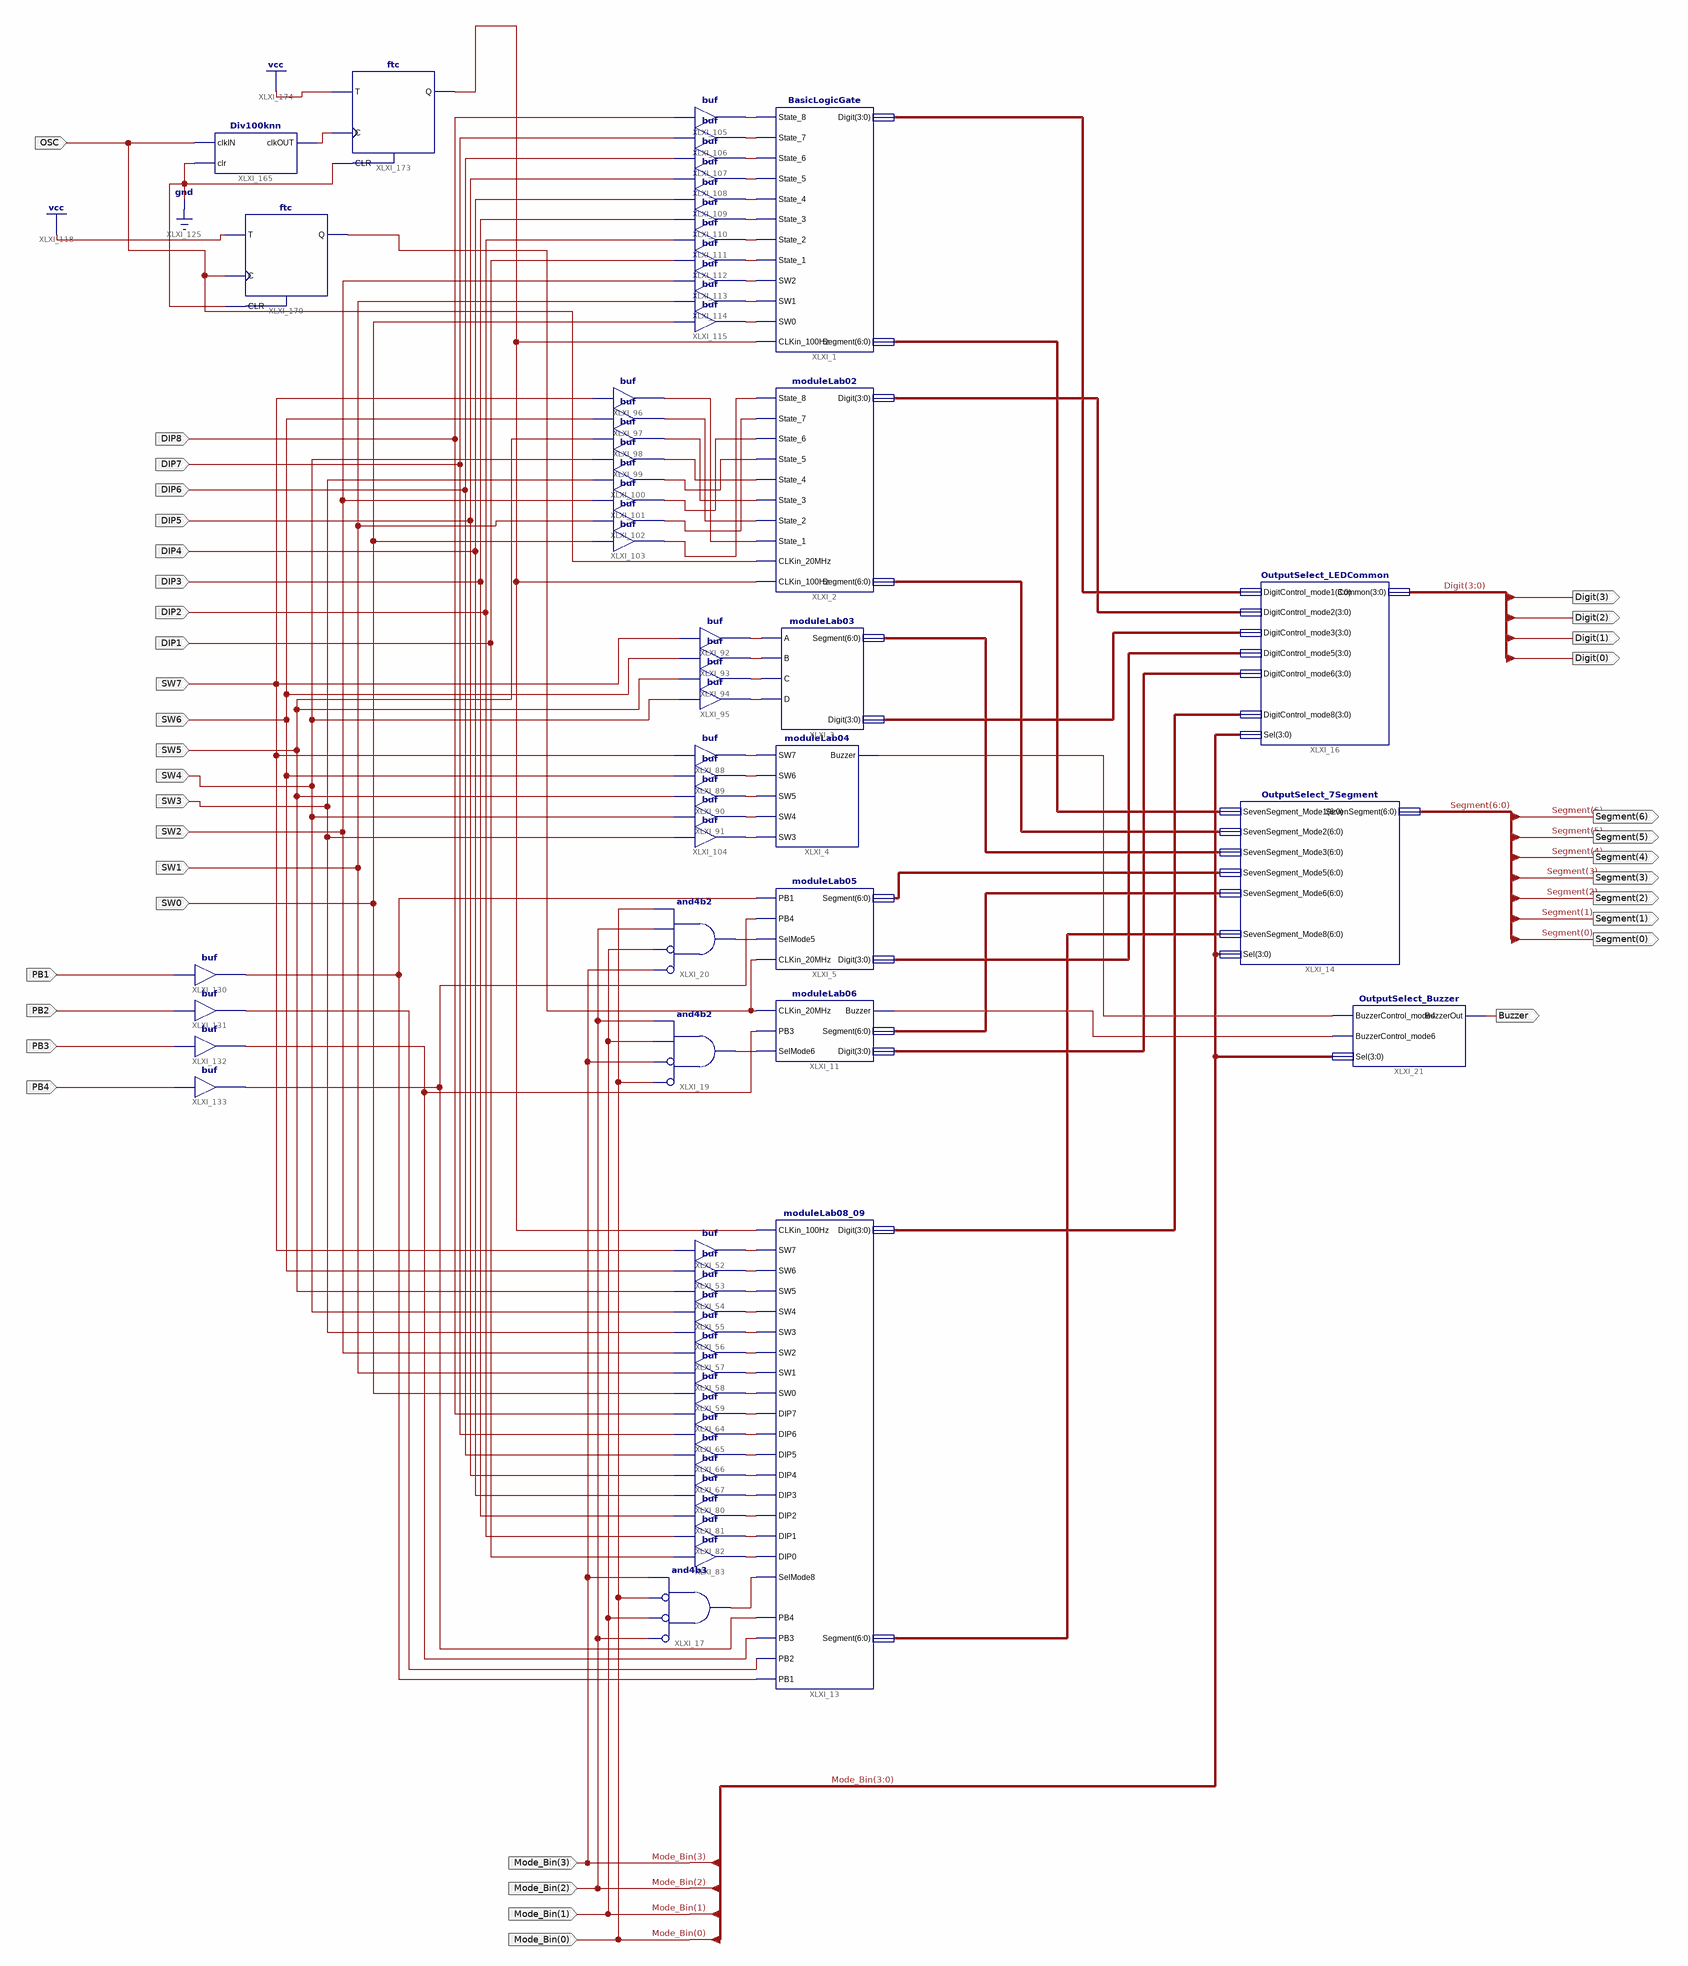
[diagram p0: schematic sheet 1]
// Xilinx ISE schematic main.sch (spartan6) as structural Verilog: 64 symbols, 37 ports
module main (
  input  [3:0] Mode_Bin,
  input  DIP7,
  input  DIP6,
  input  DIP5,
  input  DIP4,
  input  DIP3,
  input  DIP2,
  input  DIP1,
  input  SW7,
  input  SW6,
  input  SW5,
  input  SW4,
  input  SW3,
  input  SW2,
  input  SW1,
  input  SW0,
  input  DIP8,
  input  PB4,
  input  PB2,
  input  PB1,
  input  PB3,
  input  OSC,
  output [3:0] Digit,
  output [6:0] Segment,
  output Buzzer
);

  wire XLXN_35, XLXN_37, XLXN_69, XLXN_70, XLXN_182, XLXN_183, XLXN_184, XLXN_185, XLXN_186, XLXN_187,
       XLXN_188, XLXN_189, XLXN_190, XLXN_195, XLXN_196, XLXN_197, XLXN_198, XLXN_217, XLXN_218, XLXN_219,
       XLXN_220, XLXN_225, XLXN_226, XLXN_227, XLXN_228, XLXN_229, XLXN_230, XLXN_231, XLXN_232, XLXN_241,
       XLXN_242, XLXN_243, XLXN_244, XLXN_245, XLXN_246, XLXN_247, XLXN_248, XLXN_249, XLXN_250, XLXN_251,
       XLXN_252, XLXN_322, XLXN_326, XLXN_329, XLXN_339, XLXN_340, XLXN_341, XLXN_342, XLXN_343, XLXN_344,
       XLXN_345, XLXN_346, XLXN_397, XLXN_409, XLXN_423, XLXN_425;
  wire [3:0] XLXN_17, XLXN_22, XLXN_23, XLXN_24, XLXN_25, XLXN_26;
  wire [6:0] XLXN_1, XLXN_2, XLXN_3, XLXN_4, XLXN_5, XLXN_9;

  BasicLogicGate XLXI_1 (
    .State_6(XLXN_244), .State_2(XLXN_248), .SW2(XLXN_250), .Digit(XLXN_25), .Segment(XLXN_1),
    .SW1(XLXN_251), .CLKin_100Hz(XLXN_423), .SW0(XLXN_252), .State_8(XLXN_242), .State_7(XLXN_243),
    .State_5(XLXN_245), .State_4(XLXN_246), .State_3(XLXN_247), .State_1(XLXN_249));
  moduleLab02 XLXI_2 (
    .CLKin_20MHz(OSC), .CLKin_100Hz(XLXN_423), .Digit(XLXN_24), .Segment(XLXN_2), .State_6(XLXN_344),
    .State_7(XLXN_345), .State_8(XLXN_346), .State_5(XLXN_343), .State_2(XLXN_340), .State_3(XLXN_341),
    .State_1(XLXN_339), .State_4(XLXN_342));
  moduleLab04 XLXI_4 (.SW7(XLXN_225), .SW6(XLXN_226), .SW5(XLXN_227), .SW4(XLXN_228), .SW3(XLXN_241), .Buzzer(XLXN_70));
  moduleLab03 XLXI_3 (.A(XLXN_229), .B(XLXN_230), .C(XLXN_231), .D(XLXN_232), .Segment(XLXN_3), .Digit(XLXN_26));
  moduleLab05 XLXI_5 (
    .Segment(XLXN_4), .Digit(XLXN_23), .SelMode5(XLXN_182), .CLKin_20MHz(XLXN_409), .PB1(XLXN_322),
    .PB4(XLXN_329));
  moduleLab06 XLXI_11 (
    .CLKin_20MHz(XLXN_409), .PB3(XLXN_326), .SelMode6(XLXN_37), .Buzzer(XLXN_69), .Segment(XLXN_5),
    .Digit(XLXN_22));
  moduleLab08_09 XLXI_13 (
    .CLKin_100Hz(XLXN_423), .SW0(XLXN_190), .DIP7(XLXN_195), .DIP6(XLXN_196), .DIP5(XLXN_197),
    .DIP4(XLXN_198), .DIP3(XLXN_217), .DIP2(XLXN_218), .DIP1(XLXN_219), .DIP0(XLXN_220), .Digit(XLXN_17),
    .Segment(XLXN_9), .SelMode8(XLXN_35), .SW1(XLXN_189), .SW2(XLXN_188), .SW3(XLXN_187), .SW4(XLXN_186),
    .SW5(XLXN_185), .SW6(XLXN_184), .SW7(XLXN_183), .PB4(XLXN_329), .PB3(XLXN_326), .PB2(XLXN_397),
    .PB1(XLXN_322));
  OutputSelect_7Segment XLXI_14 (
    .SevenSegment_Mode1(XLXN_1), .SevenSegment_Mode2(XLXN_2), .SevenSegment_Mode3(XLXN_3),
    .SevenSegment_Mode5(XLXN_4), .SevenSegment_Mode6(XLXN_5), .SevenSegment_Mode8(XLXN_9), .Sel(Mode_Bin),
    .SevenSegment(Segment));
  OutputSelect_LEDCommon XLXI_16 (
    .DigitControl_mode1(XLXN_25), .DigitControl_mode2(XLXN_24), .DigitControl_mode3(XLXN_26),
    .DigitControl_mode5(XLXN_23), .DigitControl_mode6(XLXN_22), .DigitControl_mode8(XLXN_17), .Sel(Mode_Bin),
    .Common(Digit));
  and XLXI_17 (XLXN_35, ~Mode_Bin[2], ~Mode_Bin[1], ~Mode_Bin[0], Mode_Bin[3]);  // and4b3
  and XLXI_19 (XLXN_37, ~Mode_Bin[0], ~Mode_Bin[3], Mode_Bin[1], Mode_Bin[2]);  // and4b2
  OutputSelect_Buzzer XLXI_21 (
    .BuzzerControl_mode4(XLXN_70), .BuzzerControl_mode6(XLXN_69), .Sel(Mode_Bin), .BuzzerOut(Buzzer));
  buf XLXI_52 (XLXN_183, SW7);
  buf XLXI_53 (XLXN_184, SW6);
  buf XLXI_54 (XLXN_185, SW5);
  buf XLXI_55 (XLXN_186, SW4);
  buf XLXI_56 (XLXN_187, SW3);
  buf XLXI_57 (XLXN_188, SW2);
  buf XLXI_58 (XLXN_189, SW1);
  buf XLXI_59 (XLXN_190, SW0);
  buf XLXI_64 (XLXN_195, DIP8);
  buf XLXI_65 (XLXN_196, DIP7);
  buf XLXI_66 (XLXN_197, DIP6);
  buf XLXI_67 (XLXN_198, DIP5);
  buf XLXI_80 (XLXN_217, DIP4);
  buf XLXI_81 (XLXN_218, DIP3);
  buf XLXI_82 (XLXN_219, DIP2);
  buf XLXI_83 (XLXN_220, DIP1);
  buf XLXI_88 (XLXN_225, SW7);
  buf XLXI_89 (XLXN_226, SW6);
  buf XLXI_90 (XLXN_227, SW5);
  buf XLXI_91 (XLXN_228, SW4);
  buf XLXI_92 (XLXN_229, SW7);
  buf XLXI_93 (XLXN_230, SW6);
  buf XLXI_94 (XLXN_231, SW5);
  buf XLXI_95 (XLXN_232, SW4);
  buf XLXI_104 (XLXN_241, SW3);
  buf XLXI_105 (XLXN_242, DIP8);
  buf XLXI_106 (XLXN_243, DIP7);
  buf XLXI_107 (XLXN_244, DIP6);
  buf XLXI_108 (XLXN_245, DIP5);
  buf XLXI_109 (XLXN_246, DIP4);
  buf XLXI_110 (XLXN_247, DIP3);
  buf XLXI_111 (XLXN_248, DIP2);
  buf XLXI_112 (XLXN_249, DIP1);
  buf XLXI_113 (XLXN_250, SW2);
  buf XLXI_114 (XLXN_251, SW1);
  buf XLXI_115 (XLXN_252, SW0);
  buf XLXI_130 (XLXN_322, PB1);
  buf XLXI_131 (XLXN_397, PB2);
  buf XLXI_132 (XLXN_326, PB3);
  buf XLXI_133 (XLXN_329, PB4);
  buf XLXI_96 (XLXN_339, SW7);
  buf XLXI_97 (XLXN_340, SW6);
  buf XLXI_98 (XLXN_341, SW5);
  buf XLXI_99 (XLXN_342, SW4);
  buf XLXI_100 (XLXN_343, SW3);
  buf XLXI_101 (XLXN_344, SW2);
  buf XLXI_102 (XLXN_345, SW1);
  buf XLXI_103 (XLXN_346, SW0);
  and XLXI_20 (XLXN_182, ~Mode_Bin[3], ~Mode_Bin[1], Mode_Bin[2], Mode_Bin[0]);  // and4b2
  Div100knn XLXI_165 (.clkIN(OSC), .clr(1'b0), .clkOUT(XLXN_425));
  ftc XLXI_170 (.C(OSC), .CLR(1'b0), .T(1'b1), .Q(XLXN_409));
  ftc XLXI_173 (.C(XLXN_425), .CLR(1'b0), .T(1'b1), .Q(XLXN_423));
endmodule
